# EasyEDA schematic SCH_RTC_SYS_2022-07-16.json
TITLE: Sheet_1; REV: 1.0; Date: 2022-04-21; Sheet: 1/1; Drawn By: Radwa Refat; Company: Your Company
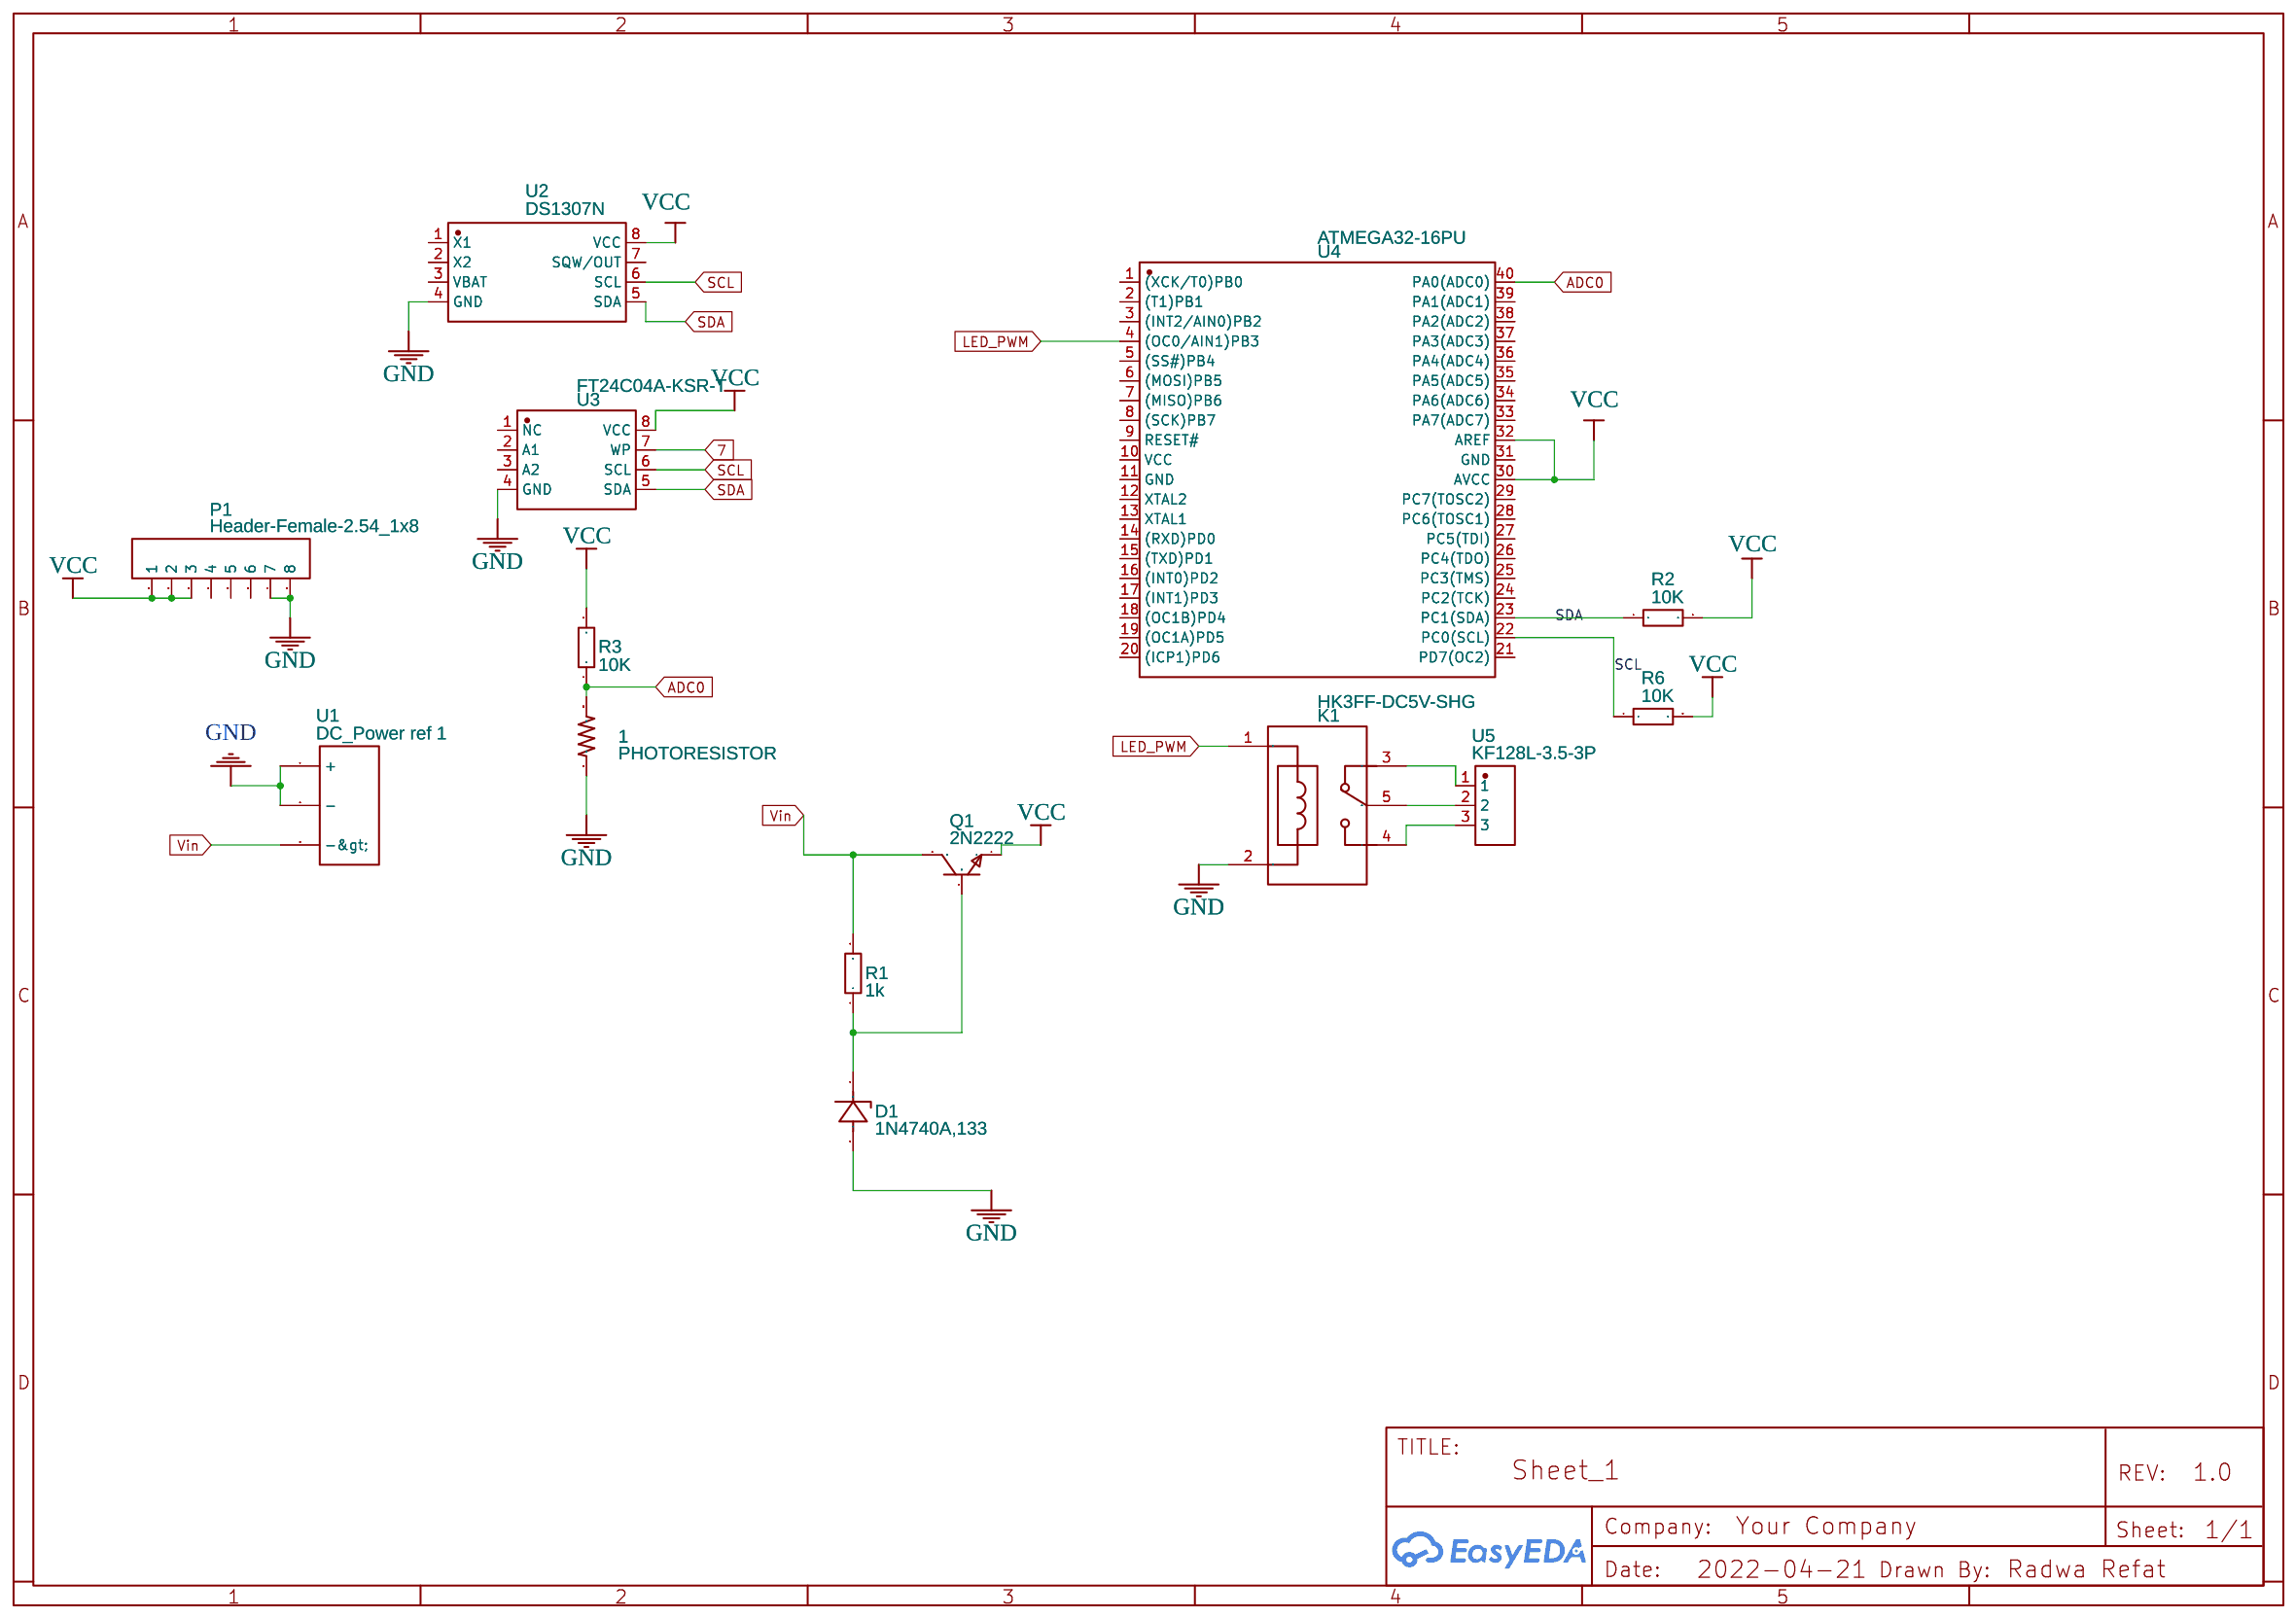
[diagram p0: schematic sheet]

## Parts
1  PHOTORESISTOR  [PHOTORESISTOR]
D1  1N4740A,133  [SOD-66_BD2.6-L4.8-P8.80-D0.9-RD]
K1  HK3FF-DC5V-SHG  [RELAY-TH_HK3FF-DCXXV-1C]
P1  Header-Female-2.54_1x8  [HDR-TH_8P-P2.54-V-F-1]
Q1  2N2222  [TO-92-3_L4.9-W3.7-P1.27-L]
R1  1k  [RES-TH_BD2.2-L6.5-P10.50-D0.6]
R2  10K  [RES-TH_BD2.2-L6.5-P10.50-D0.6]
R3  10K  [RES-TH_BD2.2-L6.5-P10.50-D0.6]
R6  10K  [RES-TH_BD2.2-L6.5-P10.50-D0.6]
U1  DC_Power ref 1  [DC POWER CONNECTOR 2.1MM]
U2  DS1307N  [DIP-8_L9.8-W6.6-P2.54-LS7.6-BL]
U3  FT24C04A-KSR-T  [SOP-8_L4.9-W3.9-P1.27-LS6.0-BL]
U4  ATMEGA32-16PU  [DIP-40_L52.3-W13.9-P2.54-LS15.2-BL]
U5  KF128L-3.5-3P  [CONN-TH_3P-P3.50_KF128L-3.5-3P]

## Library data of the parts
1 = PHOTORESISTOR: Contributor: Tahseen Hussain
D1 = 1N4740A,133: Supplier: LCSC; Supplier Part: C551363; Manufacturer: Nexperia; Contributor: LCSC; JLCPCB Part Class: Extended Part
K1 = HK3FF-DC5V-SHG: Supplier: LCSC; Manufacturer: HUIKE; Supplier Part: C27840; JLCPCB Part Class: Extended Part
P1 = Header-Female-2.54_1x8: Supplier: LCSC; Manufacturer: BOOMELE; Manufacturer Part: Female headerHDR1X8-2.54; Supplier Part: C27438; JLCPCB Part Class: Extended Part
Q1 = 2N2222: Supplier: LCSC; Manufacturer: SEMTECH; Contributor: LCSC; Supplier Part: C118536; JLCPCB Part Class: Extended Part
R1-R3 R6 = MF1/4WS ±1% 10K OTB5: Supplier: LCSC; Supplier Part: C337046; Manufacturer: FlyWin; Contributor: LCSC; JLCPCB Part Class: Extended Part; Resistance: 10kΩ
U1 = DC_Power ref 1: Manufacturer Part: 163-179PH-EX; Supplier Part: 163-179PH-EX; Supplier: Mouser; Contributor: Jeff Swartz; Manufacturer: Kobiconn
U2 = DS1307N: Supplier: LCSC; Supplier Part: C434596; Manufacturer: HGSEMI; Contributor: LCSC; JLCPCB Part Class: Extended Part
U3 = FT24C04A-KSR-T: Supplier: LCSC; Supplier Part: C232866; Manufacturer: Fremont Micro Devices; Contributor: LCSC; JLCPCB Part Class: Extended Part
U4 = ATMEGA32-16PU: Supplier: LCSC; Supplier Part: C1337273; Manufacturer: MICROCHIP(美国微芯); Contributor: LCSC; JLCPCB Part Class: Extended Part
U5 = KF128L-3.5-3P: Supplier: LCSC; Supplier Part: C474931; Manufacturer: Cixi Kefa Elec; Contributor: LCSC; JLCPCB Part Class: Extended Part

## Nets
GND: 1.P$1(1) D1.2(A) K1.2 P1.7 P1.8 U1.1(+) U1.2(-) U2.4(GND) U3.4(GND)
VCC: P1.1 P1.2 P1.3 Q1.1(E) R2.2 R3.2 R6.2 U2.8(VCC) U3.8(VCC) U4.30(AVCC) U4.32(AREF)
Vin: Q1.3(C) R1.2 U1.3(->)
7: U3.7(WP)
ADC0: 1.P$2(2) R3.1 U4.40(PA0(ADC0))
LED_PWM: K1.1 U4.4((OC0/AIN1)PB3)
SCL: R6.1 U2.6(SCL) U3.6(SCL) U4.22(PC0(SCL))
SDA: R2.1 U2.5(SDA) U3.5(SDA) U4.23(PC1(SDA))
Net-(D1-1): D1.1(K) Q1.2(B) R1.1
Net-(K1-3): K1.3 U5.1
Net-(K1-4): K1.4 U5.3
Net-(K1-5): K1.5 U5.2

Not connected (* = marked no-connect by the designer): P1 4 5 6; U2 1(X1) 2(X2) 3(VBAT) 7(SQW/OUT); U3 1(NC) 2(A1) 3(A2); U4 1((XCK/T0)PB0) 2((T1)PB1) 3((INT2/AIN0)PB2) 5((SS#)PB4) 6((MOSI)PB5) 7((MISO)PB6) 8((SCK)PB7) 9(RESET#) 10(VCC) 11(GND) 12(XTAL2) 13(XTAL1) 14((RXD)PD0) 15((TXD)PD1) 16((INT0)PD2) 17((INT1)PD3) 18((OC1B)PD4) 19((OC1A)PD5) 20((ICP1)PD6) 21(PD7(OC2)) 24(PC2(TCK)) 25(PC3(TMS)) 26(PC4(TDO)) 27(PC5(TDI)) 28(PC6(TOSC1)) 29(PC7(TOSC2)) 31(GND) 33(PA7(ADC7)) 34(PA6(ADC6)) 35(PA5(ADC5)) 36(PA4(ADC4)) 37(PA3(ADC3)) 38(PA2(ADC2)) 39(PA1(ADC1))
